# EAGLE design fan-controller (EAGLE 9.7.0)
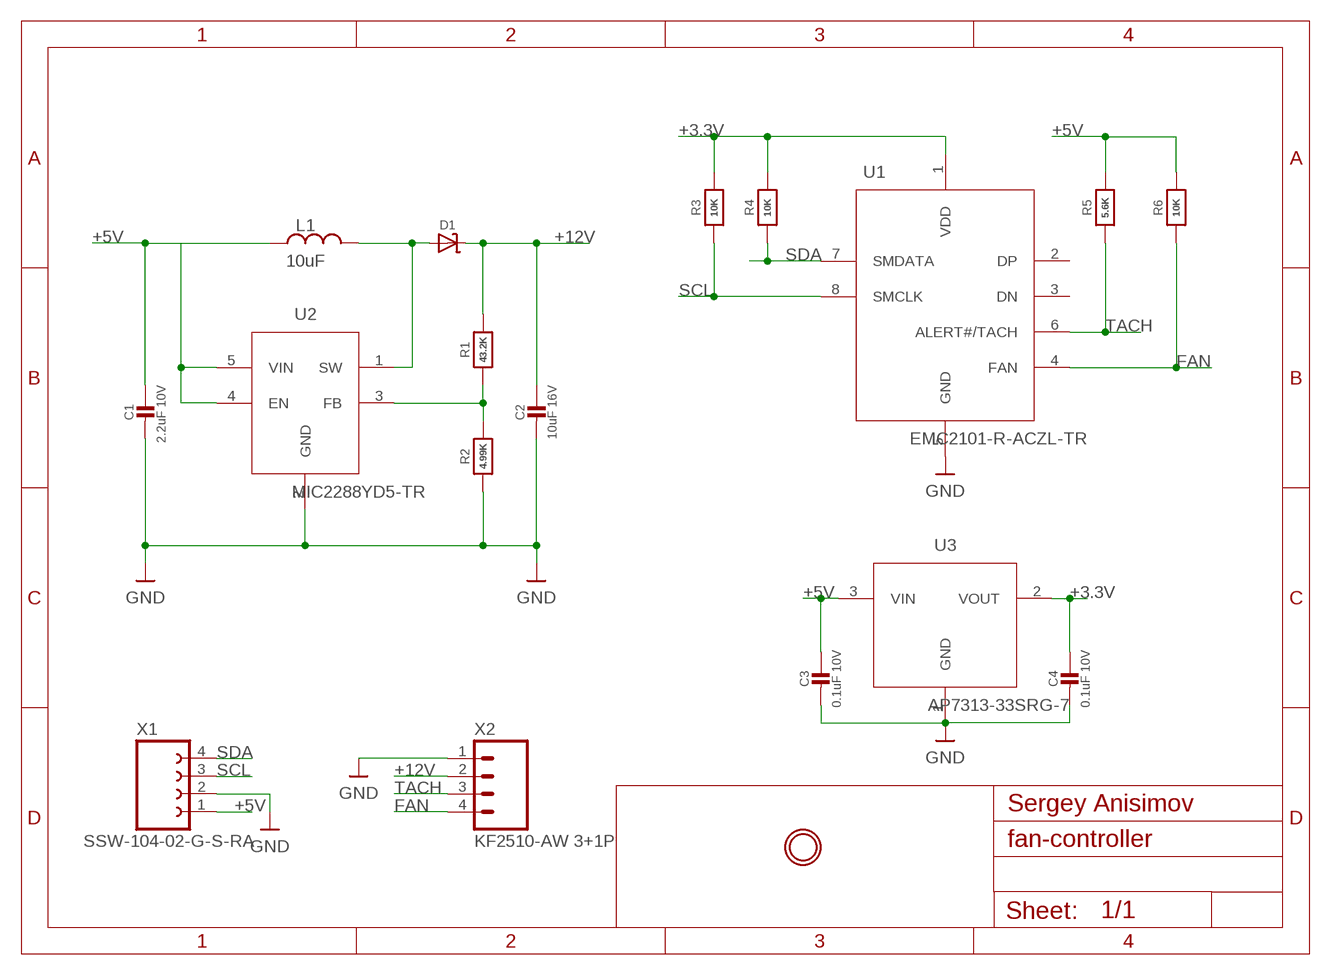
[diagram p0: schematic, sheet 1]

## Parts
C1  2.2uF 10V  CAPACITORCAP_0603  [CAPC1608X50N]
C2  10uF 16V  CAPACITORCAP_0805  [CAPC2012X139N]
C3  0.1uF 10V  CAPACITORCAP_0402_L  [CAPC1205X55N]
C4  0.1uF 10V  CAPACITORCAP_0402_L  [CAPC1205X55N]
D1  DIODE-SCHOTTKY  [CASE457−04]
L1  10uF  INDUCTOR  [INDC3225X270]
R1  43.2K  RESISTOR0603  [RESC1608X55N]
R2  4.99K  RESISTOR0603  [RESC1608X55N]
R3  10K  RESISTOR0402  [RESC1005X40N]
R4  10K  RESISTOR0402  [RESC1005X40N]
R5  5.6K  RESISTOR0402  [RESC1005X40N]
R6  10K  RESISTOR0402  [RESC1005X40N]
U1  EMC2101-R-ACZL-TR  EMC21018-PIN-TSSOP  [SOP65P490X110-8N]
U2  MIC2288YD5-TR  MIC2288YD5  [SOT95P279X100-5]
U3  AP7313-33SRG-7  LDO-3PINSOT23-GND-OUT-IN  [SOT95P240X120-3]
U$7  MOUNTING-HOLE2.7_THICK  [MOUNTINGHOLE_2.7_PLATED_THICK]
X1  SSW-104-02-G-S-RA  CON-FE-04-01  [HDRRAR4W64P254_1X4_1067X851X241B]
X2  KF2510-AW 3+1P  CON-MA-04-01  [HDRRA4W64P254_1X4_1016X300X580B]

## Nets
+3.3V: C4.1 R3.2 R4.2 U1.1(VDD) U3.2(VOUT)
+5V: C1.1 C3.1 L1.1 R5.2 R6.2 U2.4(EN) U2.5(VIN) U3.3(VIN) X1.1
+12V: C2.1 D1.C R1.1 X2.2
FAN: R6.1 U1.4(FAN) X2.4
GND: C1.2 C2.2 C3.2 C4.2 R2.1 U1.5(GND) U2.2(GND) U3.1(GND) X1.2 X2.1
N$5: D1.A L1.2 U2.1(SW)
N$6: R1.2 R2.2 U2.3(FB)
SCL: R3.1 U1.8(SMCLK) X1.3
SDA: R4.1 U1.7(SMDATA) X1.4
TACH: R5.1 U1.6(ALERT#/TACH) X2.3
Unconnected: U1.2(DP) U1.3(DN)

## Notes on the sheet
- Sergey Anisimov

## Library data of the parts
C1-C4 = Library:CAPACITOR
D1 = Library:DIODE-SCHOTTKY
L1 = Library:INDUCTOR
R1-R6 = Library:RESISTOR
U1 = Library:EMC2101
U2 = Library:MIC2288YD5
U3 = Library:LDO-3PIN
U$7 = Library:MOUNTING-HOLE: Mounting Hole For #2 screws (0.086"/2.18mm width, 0.094"/2.4mm hole) use 2.5mm; BOM: EXCLUDE
X1 = Library:CON-FE-04-01
X2 = Library:CON-MA-04-01

## Board
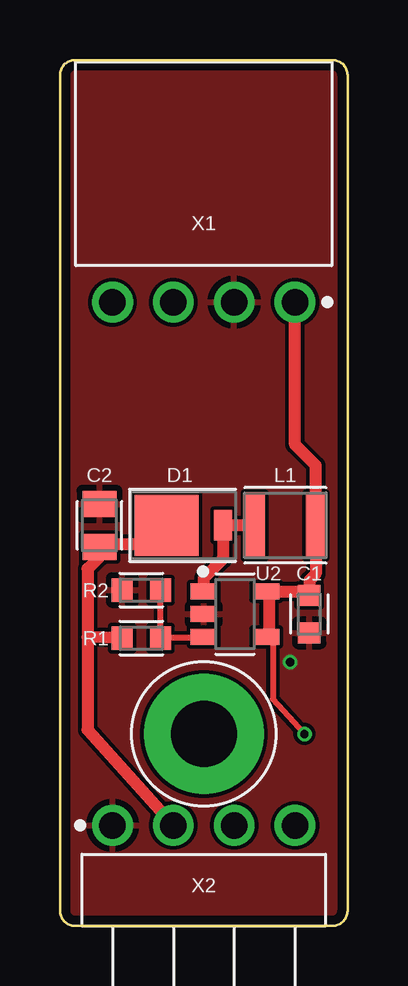
[diagram p1: board, top side]
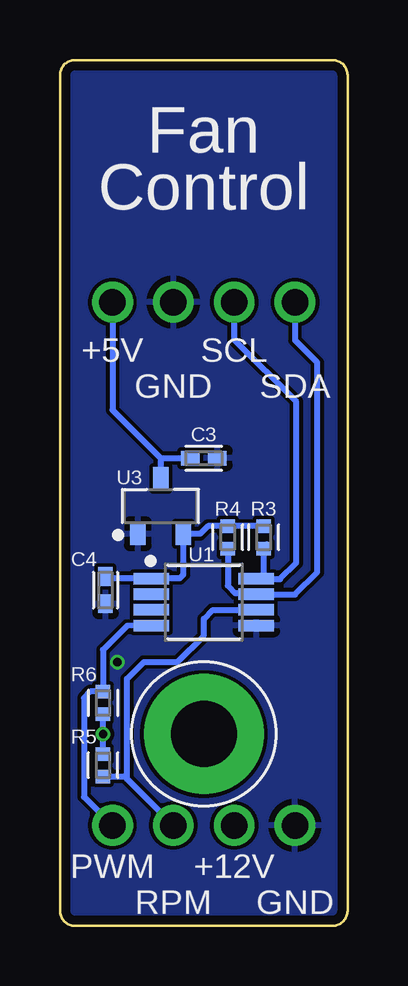
[diagram p2: board, bottom side, seen from below]

Size 12 x 36.1 mm. Coordinates in mm from the lower left corner, seen from the top.
Outline: 0,0.64 0,35.47 arc-90 0.64,36.1 11.37,36.1 arc-90 12,35.47 12,0.64 arc-90 11.37,0 0.64,0 arc-90 0,0.64
Copper layers (1*16): Top 0.0361mm / dielectric 1.572mm / Bottom 0.0361mm
Design rules "oshpark-2layer *": minimum track width 6mil, minimum drill 10mil, track to track 6mil, track to pad 6mil, pad to pad 6mil, via to via 6mil, smd to smd 6mil, copper to edge 15mil, drill to drill 6mil, minimum pad ring 5mil, minimum via ring 5mil, stop-mask expansion 2.5mil, vias tented up to drill 14mil, thermal gap 10mil

### Footprints (pad centres in the part's own frame; a part is rotated, then mirrored left to right if it is on the bottom)
CAPC1608X50N = smd 0.871 x 0.931: 1 -0.78,0; 2 0.78,0
CAPC2012X139N = smd 1.082 x 1.422: 1 -0.895,0; 2 0.895,0
CAPC1205X55N = smd 0.776 x 0.604: 1 -0.567,0; 2 0.567,0
CASE457−04 = smd 0.762 x 1.27: A 0.699,0 | smd 2.67 x 2.54: C -1.653,0
INDC3225X270 = smd 0.85 x 2.7: 1 -1.275,0; 2 1.275,0
RESC1608X55N = smd 0.872 x 0.982: 1 -0.8,0; 2 0.8,0
RESC1005X40N = smd 0.563 x 0.604: 1 -0.47,0; 2 0.47,0
SOP65P490X110-8N = smd 1.479 x 0.478: 1 -2.192,0.975; 2 -2.192,0.325; 3 -2.192,-0.325; 4 -2.192,-0.975; 5 2.192,-0.975; 6 2.192,-0.325; 7 2.192,0.325; 8 2.192,0.975
SOT95P279X100-5 = smd 1.1 x 0.66: 1 -1.3,0.95; 2 -1.3,0; 3 -1.3,-0.95; 4 1.3,-0.95; 5 1.3,0.95
SOT95P240X120-3 = smd 0.95 x 0.65: 1 -1.15,0.95; 2 -1.15,-0.95; 3 1.15,0
MOUNTINGHOLE_2.7_PLATED_THICK = drill 2.75 pad 5: P$1 0,0
HDRRAR4W64P254_1X4_1067X851X241B = drill 1.105 pad 1.705: 1 0,0; 2 2.54,0; 3 5.08,0; 4 7.62,0
HDRRA4W64P254_1X4_1016X300X580B = drill 1.105 pad 1.705: 1 0,0; 2 2.54,0; 3 5.08,0; 4 7.62,0

### Placement (x,y rotation side)
C1  10.4,13 270 top
C2  1.65,16.7 90 top
C3  6,19.5 0 bottom
C4  10.1,14 270 bottom
D1  6.1,16.7 0 top
L1  9.4,16.7 180 top
R1  3.4,12 0 top
R2  3.4,14 0 top
R3  3.5,16.2 90 bottom
R4  5,16.2 90 bottom
R5  10.2,6.7 90 bottom
R6  10.2,9.3 270 bottom
U1  6,13.5 0 bottom
U2  7.3,13 0 top
U3  7.8,17.5 90 bottom
U$7  6,8 0 top
X1  9.81,26 180 top
X2  2.19,4.19 0 top

### Tracks (layer width: path | path; a pad name or v marks a point on that pad's centre or on a via)
+3.3V
  Bottom 0.254: U1.1 8.18,14.51 8.18,14.5 | U1.1 8.23,14.5 10.03,14.5 C4.1 | R3.2 R4.2 5.83,16.67 6.15,16.35 U3.2 6.85,14.65 7,14.5 8.17,14.5 U1.1
+5V  (via drill 0.35)
  Top 0.254: U2.4 8.88,11.81 8.88,9.45 v10.2,8
  Top 0.508: U2.4 8.73,12 8.73,13.85 U2.5 10.34,13.95 10.41,13.88 | 10.41,13.88 C1.1 | X1.1 9.81,20.06 10.68,19.2 L1.1 10.68,14.68 10.41,14.41 10.41,13.88
  Bottom 0.254: R5.2 v10.2,8 R6.2 | 7.8,19.5 C3.1 | 7.8,19.5 U3.3 | X1.1 9.81,21.51 7.8,19.5
+12V
  Top 0.508: D1.C 3.65,15.92 1.68,15.92 C2.1 1.65,15.39 1.15,14.89 1.15,12.04 | X2.2 1.15,8.18 1.15,12.04 | R1.1 1.15,12.04
FAN
  Bottom 0.254: U1.4 9.19,12.51 10.2,11.51 R6.1 10.73,9.77 11,9.5 11,5.38 X2.4
GND  (via drill 0.35)
  other vias: 9.6,11
  pour Top: -0.67,-1.17 12.87,-1.17 12.87,36.77 -0.67,36.77
  pour Bottom: -0.67,-1.17 12.87,-1.17 12.87,36.77 -0.67,36.77
N$5
  Top 0.508: L1.2 D1.A | D1.A 6.84,16.66 | U2.1 6,14.5 6.8,15.3 D1.A
N$6
  Top 0.254: R1.2 R2.2 | R1.2 4.16,11.98 | U2.3 5.95,12 R1.2
SCL
  Bottom 0.254: 3.38,15.91 R3.1 3.5,14.47 | 3.54,14.46 U1.8 3.5,14.47 | 3.5,14.47 2.82,14.46 2.14,15.14 2.14,21.86 4.73,24.45 X1.3
SDA
  Bottom 0.254: X1.4 2.19,24.41 1.27,23.5 1.27,14.74 2.2,13.81 U1.7 3.81,13.87 4.68,13.87 5,14.19 R4.1
TACH
  Bottom 0.254: U1.6 5.63,13.16 6,12.8 6,12.1 7.1,11 8.5,11 9.2,10.3 9.2,6.23 | R5.1 9.2,6.23 | 9.2,6.23 9.2,6.12 X2.3

### Text on the board
bPlace: Fan / Control | SCL | +5V | SDA | GND | +12V | PWM | GND | RPM